# EAGLE schematic eDP_DLT_10inch (EAGLE 9.4.2)
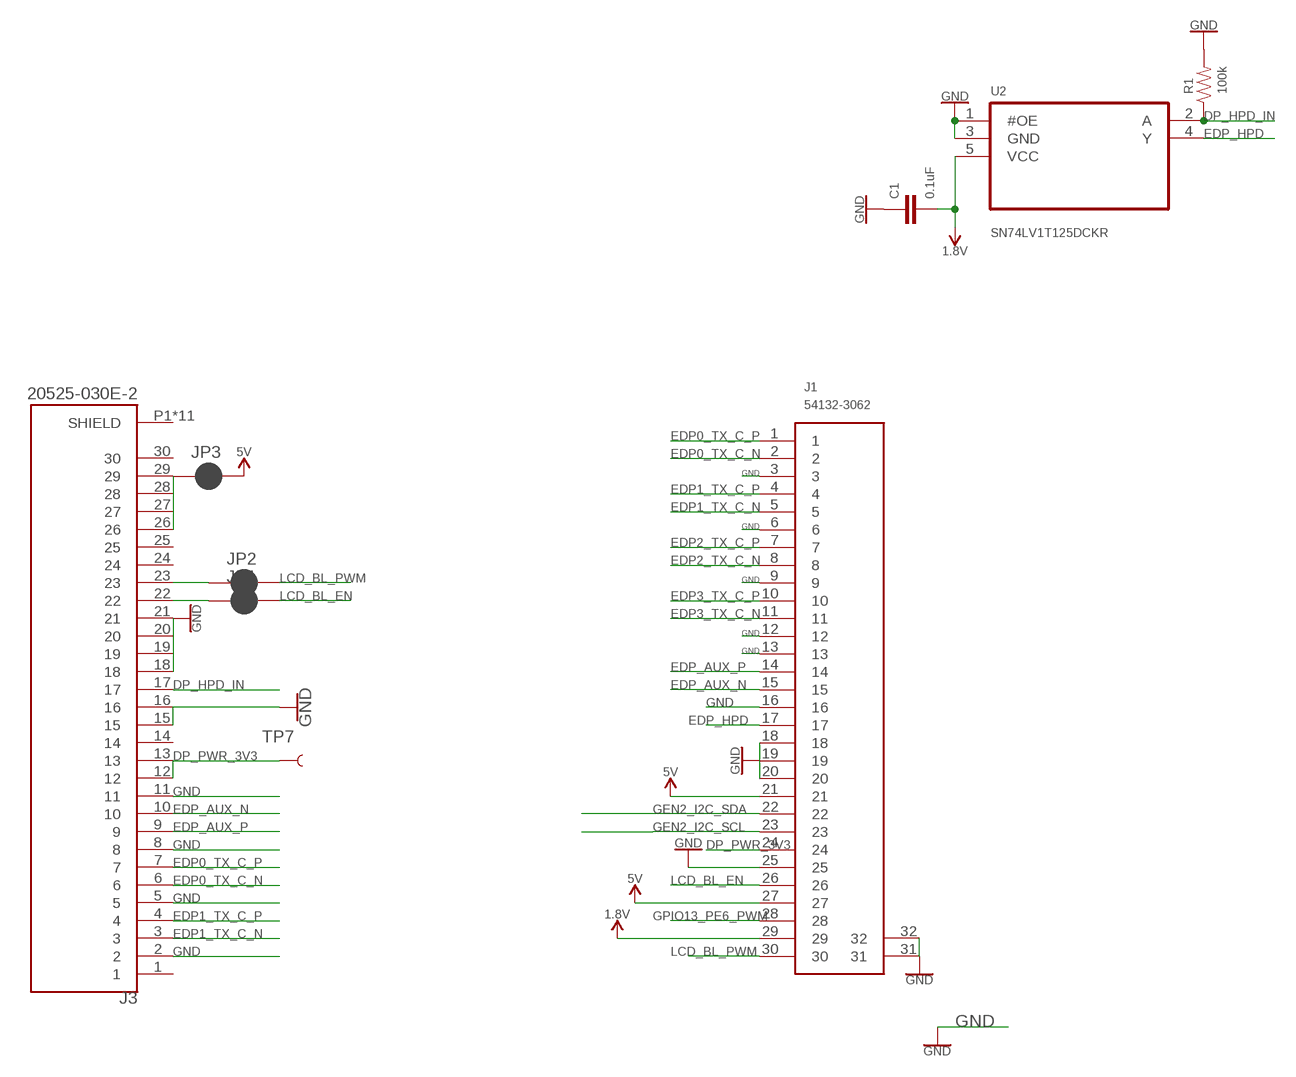
[diagram p0: schematic, sheet 1]

## Parts
C1  0.1uF  10NF-0603-50V-10%  [0603]
J1  54132-3062  [54132-3062]
J3  20525-030E-2  [I-PEX_20525-030E-2]
JP1  JUMPER-SMT_2_NC_PASTE_NO-SILK  [SMT-JUMPER_2_NC_PASTE_NO-SILK]
JP2  JUMPER-SMT_2_NC_PASTE_NO-SILK  [SMT-JUMPER_2_NC_PASTE_NO-SILK]
JP3  JUMPER-SMT_2_NC_PASTE_NO-SILK  [SMT-JUMPER_2_NC_PASTE_NO-SILK]
R1  100k  RESISTOR0603-RES  [0603-RES]
TP7  TEST-POINT3  [PAD.03X.03]
U2  SN74LV1T125DCKR  [SOT65P210X110-5N]

## Nets
1.8V: C1.2 J1.29 U2.5(VCC)
5V: J1.21 J1.27 JP3.2
DP_HPD_IN: J3.17 R1.1 U2.2(A)
DP_PWR_3V3: J1.24 J3.12 J3.13 TP7.P$1
EDP0_TX_C_N: J1.2 J3.6
EDP0_TX_C_P: J1.1 J3.7
EDP1_TX_C_N: J1.5 J3.3
EDP1_TX_C_P: J1.4 J3.4
EDP2_TX_C_N: J1.8
EDP2_TX_C_P: J1.7
EDP3_TX_C_N: J1.11
EDP3_TX_C_P: J1.10
EDP_AUX_N: J1.15 J3.10
EDP_AUX_P: J1.14 J3.9
EDP_HPD: J1.17 U2.4(Y)
GEN2_I2C_SCL: J1.23
GEN2_I2C_SDA: J1.22
GND: C1.1 J1.3 J1.6 J1.9 J1.12 J1.13 J1.16 J1.18 J1.19 J1.20 J1.25 J1.31 J1.32 J3.2 J3.5 J3.8 J3.11 J3.15 J3.16 J3.18 J3.19 J3.20 J3.21 R1.2 U2.1(#OE) U2.3(GND)
GPIO13_PE6_PWM: J1.28
LCD_BL_EN: J1.26 JP1.2
LCD_BL_PWM: J1.30 JP2.2
N$1: J3.22 JP1.1
N$2: J3.23 JP2.1
N$3: J3.26 J3.27 J3.28 J3.29 JP3.1
Unconnected: J3.1 J3.14 J3.24 J3.25 J3.30 J3.P1(SHIELD) J3.P2(SHIELD) J3.P3(SHIELD) J3.P4(SHIELD) J3.P5(SHIELD) J3.P6(SHIELD) J3.P7(SHIELD) J3.P8(SHIELD) J3.P9(SHIELD) J3.P10(SHIELD) J3.P11(SHIELD)

## Library data of the parts
C1 = SparkFun-Capacitors:10NF: 0.01uF/10nF/10,000pF ceramic capacitors A capacitor is a passive two-terminal electrical component used to store electrical energy temporarily in an electric field. CAP-09321; PROD_ID: CAP-00867; VALUE: 10nF
J1 = 54132-3062:54132-3062: Connector 0.5mm, FFC/FPC, SMT,r/a,30w,Au Molex FFC/FPC SMT Series 0.5mm Pitch 30 Way Right Angle SMT Female FPC Connector, ZIF Bottom Contact Source: Datasheet <https://componentsearchengine.com/Datasheets/1/54132-3062.pdf>; DESCRIPTION: Connector 0.5mm, FFC/FPC, SMT,r/a,30w,Au Molex FFC/FPC SMT Series 0.5mm Pitch 30 Way Right Angle SMT Female FPC Connector, ZIF Bottom Contact; HEIGHT: mm; MANUFACTURER_NAME: Molex; MANUFACTURER_PART_NUMBER: 54132-3062; MOUSER_PART_NUMBER: 538-54132-3062; MOUSER_PRICE-STOCK: https://www.mouser.com/Search/Refine.aspx?Keyword=538-54132-3062
J3 = 20525-030E-2:20525-030E-2: CABLINE-CA_30_RECE_WITHOUTBOSS; AVAILABILITY: Unavailable; MF: I-PEX; MP: 20525-030E-2; PACKAGE: None; PRICE: None
JP1-JP3 = SparkFun-Jumpers:JUMPER-SMT_2_NC_PASTE: Normally closed solder jumper This jumper has an aperture in the stencil to allow solder paste to bridge the split in the wire so it's normally closed (NC). Wick off the solder to open the connection. Reapply solder to reclose the connection.
R1 = SparkFun-Passives:RESISTOR: Resistor Basic schematic elements and footprints for 0603, 1206, and PTH resistors.
TP7 = SparkFun-Connectors:TEST-POINT: SparkFun Test Points Bare copper test points for troubleshooting or In-Circuit-Testing. These are used by our Production team for verifying production board runs using pogo-pins on test beds. SparkFun Products: SparkFun LSM9DS1 Breakout <https://www.sparkfun.com/products/13284> SparkFun PSOC <https://www.sparkfun.com/products/13714> SparkFun Load Cell Amplifier <https://www.sparkfun.com/products/13879>
U2 = SN74LV1T125DCKR:SN74LV1T125DCKR: None; AVAILABILITY: Unavailable; DESCRIPTION: Single Power Supply, Single BUFFER GATE w/ 3-State Output _active low enable_ 5-SC70 -40 to 125; MF: Texas Instruments; MP: SN74LV1T125DCKR; PACKAGE: SC-70-5 Texas Instruments; PRICE: None